# Altium schematic sheet 1_P1.schdoc
size 307 x 264 mm; Symbol: Drawing-Symbol_A4; Device: Drawing-Symbol_A4; Company: 嘉立创EDA; Version: V1.0; Page Size: A4; @Project Name: 25国赛; @Page Count: 1; @Update Date: 2025-08-01; @Create Date: 2025-08-01; @Schematic Name: AD603; @Page No: 1; @Page Name: P1; @Create Time: 16:34:04; @Update Time: 20:31:26; Width: 1170; Height: 1000; Region Start: 1; X Region Count: 6; Y Region Count: 4; Blade Width: 10; Title Block Position: 3; @Board Name: AD603VCA
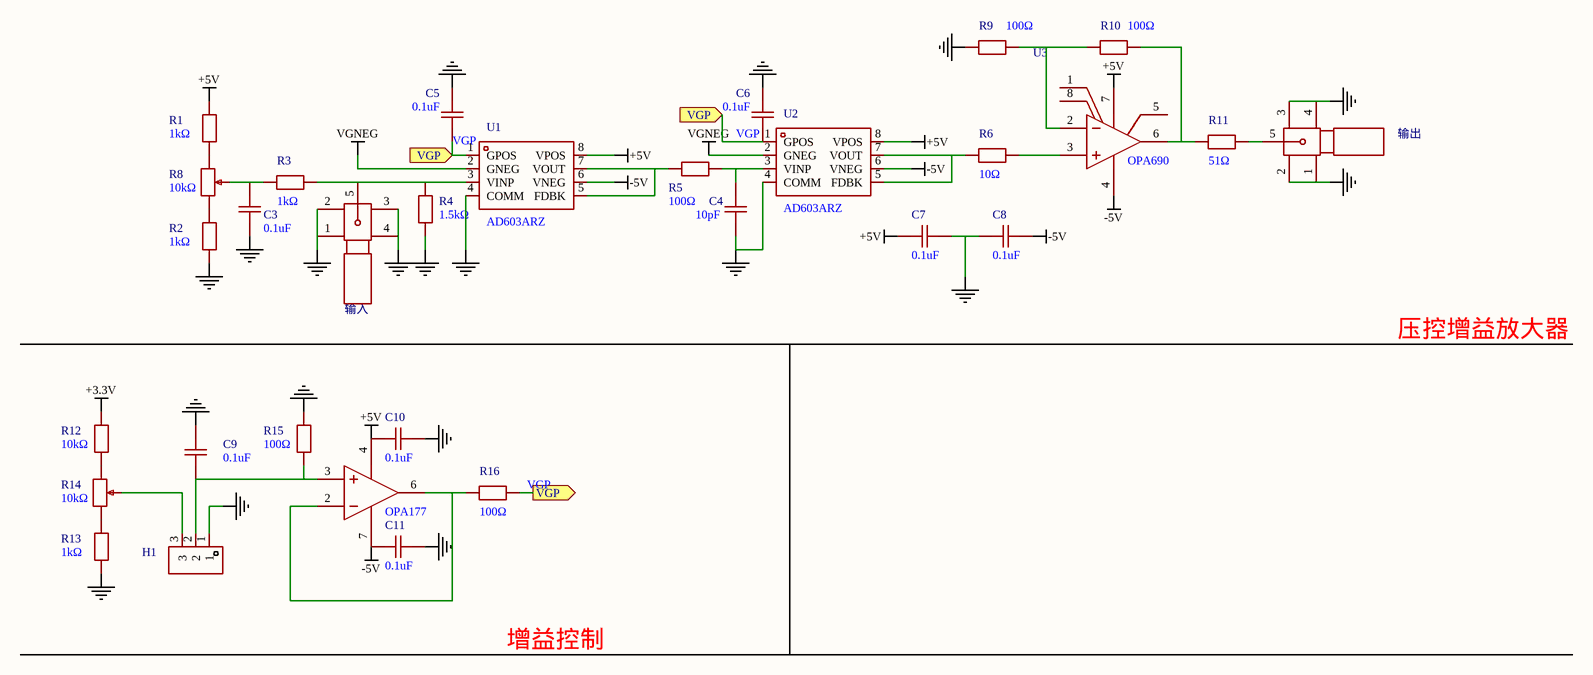
[diagram p0: 1_P1.schdoc]

## Parts
C3  0.1uF  [CAP-TH_L8.0-W3.0-P5.0-D0.60]
C4  10pF  [CAP-TH_L8.0-W3.0-P5.0-D0.60]
C5  0.1uF  [CAP-TH_L8.0-W3.0-P5.0-D0.60]
C6  0.1uF  [CAP-TH_L8.0-W3.0-P5.0-D0.60]
C7  0.1uF  [CAP-TH_L8.0-W3.0-P5.0-D0.60]
C8  0.1uF  [CAP-TH_L8.0-W3.0-P5.0-D0.60]
C9  0.1uF  [CAP-TH_L8.0-W3.0-P5.0-D0.60]
C10  0.1uF  [CAP-TH_L8.0-W3.0-P5.0-D0.60]
C11  0.1uF  [CAP-TH_L8.0-W3.0-P5.0-D0.60]
H1  PZ254V-11-03P  [HDR-TH_3P-P2.54-V-M]  (value not drawn)
R1  1kΩ  [RES-TH_BD2.7-L6.2-P10.20-D0.4]
R2  1kΩ  [RES-TH_BD2.7-L6.2-P10.20-D0.4]
R3  1kΩ  [RES-TH_BD2.7-L6.2-P10.20-D0.4]
R4  1.5kΩ  [RES-TH_BD2.7-L6.2-P10.20-D0.4]
R5  100Ω  [RES-TH_BD2.7-L6.2-P10.20-D0.4]
R6  10Ω  [RES-TH_BD2.7-L6.2-P10.20-D0.4]
R8  10kΩ  [RES-ADJ-TH_3P-L10.0-W10.0-P2.50-BL-BS]
R9  100Ω  [RES-TH_BD2.7-L6.2-P10.20-D0.4]
R10  100Ω  [RES-TH_BD2.7-L6.2-P10.20-D0.4]
R11  51Ω  [RES-TH_BD2.7-L6.2-P10.20-D0.4]
R12  10kΩ  [RES-TH_BD2.7-L6.2-P10.20-D0.4]
R13  1kΩ  [RES-TH_BD2.7-L6.2-P10.20-D0.4]
R14  10kΩ  [RES-ADJ-TH_3P-L10.0-W10.0-P2.50-BL-BS]
R15  100Ω  [RES-TH_BD2.7-L6.2-P10.20-D0.4]
R16  100Ω  [RES-TH_BD2.7-L6.2-P10.20-D0.4]
U1  AD603ARZ  [SOIC-8_L4.9-W3.9-P1.27-LS6.0-BL]
U2  AD603ARZ  [SOIC-8_L4.9-W3.9-P1.27-LS6.0-BL]
U3  OPA690  [SOIC-8_L4.9-W3.9-P1.27-LS6.0-BL]
U4  OPA177  [PDIP-8_L9.6-W6.4-P2.54-LS7.6-BL]  (part A of 2)
输入  BWSMA-KE-Z001  [SMA-TH_BWSMA-KE-Z001]  (value not drawn)
输出  BWSMA-KE-Z001  [SMA-TH_BWSMA-KE-Z001]  (value not drawn)

## Ports
VGP (in), VGP (out)

## Nets
+3.3V: R12.1
+5V: C7.1 C10.1 R1.1 U1.8(VPOS) U2.8(VPOS) U3.7(+VS) U4.4(V-)
-5V: C8.2 C11.2 U1.6(VNEG) U2.6(VNEG) U3.4(-VS) U4.7(V+)
GND: C3.2 C4.2 C5.1 C6.1 C7.2 C8.1 C9.2 C10.2 C11.1 H1.1 R2.2 R4.1 R9.1 R13.2 R15.1 U1.4(COMM) U2.4(COMM) 输入.1 输入.2 输入.3 输入.4 输出.1 输出.2 输出.3 输出.4
VGNEG: U1.2(GNEG) U2.2(GNEG)
VGP: C5.2 C6.2 R16.2 U1.1(GPOS) U2.1(GPOS) ; port VGP
NetC3_1: C3.1 R3.1 R8.2
NetC4_1: C4.1 R5.2 U2.3(VINP)
NetC9_1: C9.1 H1.2 R15.2 U4.3(IN+)
NetH1_3: H1.3 R14.2
NetR1_2: R1.2 R8.3
NetR2_1: R2.1 R8.1
NetR3_2: R3.2 R4.2 U1.3(VINP) 输入.5
NetR5_1: R5.1 U1.5(FDBK) U1.7(VOUT)
NetR6_1: R6.1 U2.5(FDBK) U2.7(VOUT)
NetR6_2: R6.2 U3.3(Noninverting_Input)
NetR9_2: R9.2 R10.1 U3.2(Inverting_Input)
NetR10_2: R10.2 R11.1 U3.6(Output)
NetR11_2: R11.2 输出.5
NetR12_2: R12.2 R14.3
NetR13_1: R13.1 R14.1
NetR16_1: R16.1 U4.2(IN-) U4.6(OUT)

Not connected (* = marked no-connect by the designer): U3 1(NC) 5(NC) 8(DIS#)

## Notes on the sheet
- 压控增益放大器
- 增益控制
- 1
- 2
- 3
- 4
- 5
- 6
- A
- B
- C
- 原理图
- AD603
- 创建日期
- 更新日期
- 2025-08-01
- D
- 板子
- 绘制
- AD603VCA
- 图页
- P1
- 审阅
- 版本
- 尺寸
- 25国赛
- 页    1    共    1
- V1.0
- A4
- 嘉立创EDA

## Library data of the parts
C3-C11 = R08B1B102KN0B0S0N0: Manufacturer: STE(松田); Add into BOM: yes; Tolerance: ±10%; Voltage Rated: 2kV; Temperature Coefficient: Y5P; φD: 8mm; Body Thickness: 3mm; Symbol: R08B1B102KN0B0S0N0; Device: R08B1B102KN0B0S0N0; LCSC Part Name: 1nF ±10% 2kV; Manufacturer Part: R08B1B102KN0B0S0N0; Supplier Footprint: 插件,P=5mm; JLCPCB Part Class: 扩展库; Datasheet: https://atta.szlcsc.com/upload/public/pdf/source/20190806/C366874_7FA13009B587FE73099181E533DD7411.pdf; Supplier: LCSC; Convert to PCB: yes; Lead Spacing: 5mm
  C3 C5-C11: Value: 0.1uF
  C4: Value: 10pF
H1 = PZ254V-11-03P: Manufacturer: XFCN(兴飞); Symbol: PZ254V-11-03P_C2937625; Add into BOM: yes; Pin Structure: 1x3P; Pitch: 2.54mm; Circluar Pins/Square Pins: 方针; Current Rating (Max): 3A; Voltage Rating (Max): 250V; Device: PZ254V-11-03P; LCSC Part Name: 间距:2.54mm 1x3P 直插 方针; Supplier Part: C2937625; Manufacturer Part: PZ254V-11-03P; Supplier Footprint: 插件,P=2.54mm; JLCPCB Part Class: 扩展库; Datasheet: https://atta.szlcsc.com/upload/public/pdf/source/20200309/C492402_8335C3D49C4E4C618838D59BB1D024C1.pdf; Supplier: LCSC; Convert to PCB: yes; Row Spacing: -; Mounting Type: 直插; Number of Rows: 单排; Number of Pins: 3P; Length of Mating Pin: 6mm; Insulation Height: 2.5mm; Length of End Connection Pin: 3mm; Operating Temperature Range: -40℃~+105℃; Color: 黑色
R1-R6 R9-R13 R15 R16 = MF1/4W-1K±1%-ST52: Manufacturer: VO(翔胜); Add into BOM: yes; Tolerance: ±1%; Overload Voltage (Max): 250V; Power(Watts): 250mW; Temperature Coefficient: ±100ppm/℃; Symbol: MF1/4W-1K±1%-ST52; Device: MF1/4W-1K±1%-ST52; LCSC Part Name: 金属膜电阻 1kΩ ±1% 250mW; Manufacturer Part: MF1/4W-1K±1%-ST52; Supplier Footprint: 插件,D2.7xL6.2mm; JLCPCB Part Class: 扩展库; Datasheet: https://atta.szlcsc.com/upload/public/pdf/source/20200609/C601728_5AA4C0C8E12E11069DA2C3356F29D1F2.pdf; Supplier: LCSC; Convert to PCB: yes; Type: 金属膜电阻; Operating Temperature Range: -55℃~+155℃
  R1-R3 R13: Value: 1kΩ
  R4: Value: 1.5kΩ
  R5 R9 R10 R15 R16: Value: 100Ω
  R6: Value: 10Ω
  R11: Value: 51Ω
  R12: Value: 10kΩ
R8 R14 = 3296W-1-103LF: Manufacturer: BOURNS; Add into BOM: yes; Tolerance: ±10%; Power(Watts): 500mW; Temperature Coefficient: ±100ppm/℃; Turns: 25; Symbol: 3296W-1-103LF; Device: 3296W-1-103LF; LCSC Part Name: 10kΩ ±10%; Manufacturer Part: 3296W-1-103LF; Supplier Footprint: SIP-3P,9.5x4.8mm; JLCPCB Part Class: 扩展库; Datasheet: https://atta.szlcsc.com/upload/public/pdf/source/20151026/1457707506403.pdf; Supplier: LCSC; Convert to PCB: yes; Value: 10kΩ
U1 U2 = AD603ARZ: Manufacturer: ADI(亚德诺); Symbol: AD603ARZ_C7455150; Add into BOM: yes; Amplifier Type: VGA; Number of Channels: 单路; -3dB Bandwidth: 90MHz; Slew Rate: 275V/us; Voltage - Supply: -5V~5V; Output Type: 推挽; Rail to Rail: 轨到轨输出; Output Current: 3mA; Current - Supply: 12.5mA; Device: AD603ARZ; LCSC Part Name: 低噪声、90 MHz可变增益放大器; Supplier Part: C7455150; Manufacturer Part: AD603ARZ; Supplier Footprint: SOIC-8; JLCPCB Part Class: 扩展库; Datasheet: https://atta.szlcsc.com/upload/public/pdf/source/20200225/C428870_2540098E542F69B8418644EFC7A80A81.pdf; Supplier: LCSC; Convert to PCB: yes; Operating Temperature: -40℃~+85℃
U3 = OPA690IDRG4: Manufacturer: TI(德州仪器); Add into BOM: yes; Symbol: OPA690IDRG4; Device: OPA690IDRG4; LCSC Part Name: OPA690IDRG4; Supplier Part: C2059580; Manufacturer Part: OPA690; Supplier Footprint: SOIC-8; JLCPCB Part Class: 扩展库; Datasheet: https://www.ti.com/cn/lit/gpn/opa690; Supplier: LCSC; Convert to PCB: yes
U4 = OPA177FPG4: Manufacturer: TI(德州仪器); Add into BOM: yes; Relevance: []; Symbol: OPA177FPG4; Device: OPA177FPG4; LCSC Part Name: OPA177FPG4; Supplier Part: C4367209; Manufacturer Part: OPA177; Supplier Footprint: PDIP-8; JLCPCB Part Class: 扩展库; Datasheet: https://www.ti.com/cn/lit/gpn/opa177; Supplier: LCSC; Convert to PCB: yes
输入 输出 = BWSMA-KE-Z001_C496549: Manufacturer: BAT WIRELESS(蝙蝠无线); Add into BOM: yes; Connector Type: 板端; Interface Type: 内孔; Number of Ports: 1; RF Series: SMA; Impedance: 50Ω; Style: 正脚; Symbol: BWSMA-KE-Z001; Device: BWSMA-KE-Z001_C496549; LCSC Part Name: 内孔 SMA 正脚; Supplier Part: C496549; Manufacturer Part: BWSMA-KE-Z001; Supplier Footprint: 插件; JLCPCB Part Class: 扩展库; Datasheet: https://atta.szlcsc.com/upload/public/pdf/source/20221228/40BF41E56A06003A0210E1785CA66EA6.pdf; Supplier: LCSC; Convert to PCB: yes; Interface Diameter: -; Interface Length/Height: -; Frequency-Max: -; Contact Material: -; Contact Plating: -; Operating Temperature Range: -65℃~+165℃; Soldering Temperature(Max): -